# EAGLE schematic ETESTER-1 (EAGLE 9.6.2)
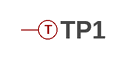
[diagram p0: schematic, sheet 1]

## Parts
TP1  TESPOINT-SMD1.5MM  [TESTPOINT-1.5MM]
Unconnected: TP1.1

## Library data of the parts
TP1 = Generics_stg:TESPOINT